# EAGLE design DCDC_ACCUMULATOR (EAGLE 9.2.1)
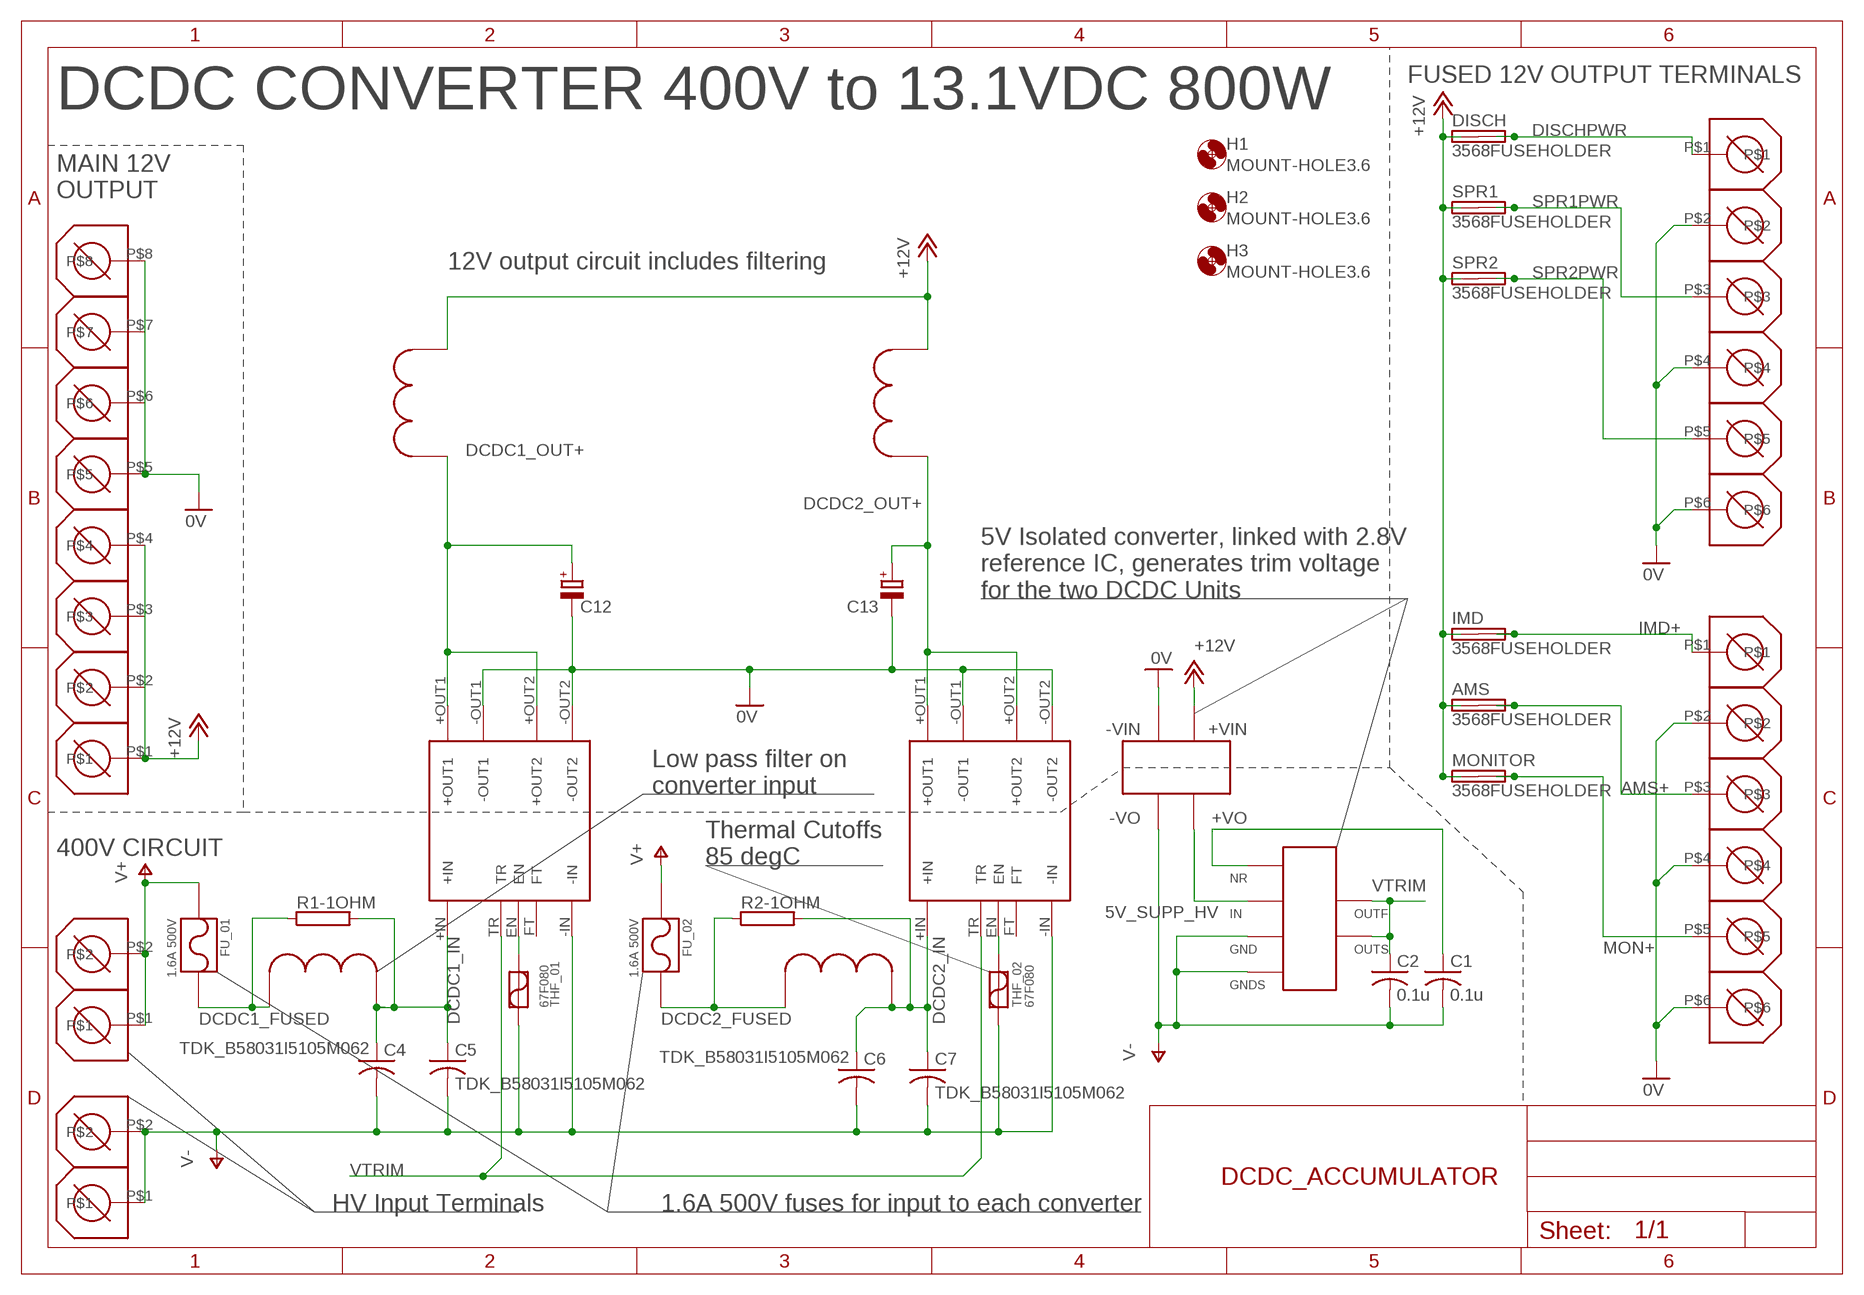
[diagram p0: schematic, sheet 1]

## Parts
AMS  3568FUSEHOLDER  [3568]
C1  0.1u  C-USC0805  [C0805]
C2  0.1u  C-USC0805  [C0805]
C4  TDK_B58031I5105M062  [TDK_CERALINK_USTYLE]
C5  TDK_B58031I5105M062  [TDK_CERALINK_USTYLE]
C6  TDK_B58031I5105M062  [TDK_CERALINK_USTYLE]
C7  TDK_B58031I5105M062  [TDK_CERALINK_USTYLE]
C12  CPOL-EUE7.5-16  [E7,5-16]
C13  CPOL-EUE7.5-16  [E7,5-16]
DISCH  3568FUSEHOLDER  [3568]
FU_01  1.6A 500V  LF_885  [LF_885]
FU_02  1.6A 500V  LF_885  [LF_885]
H1  MOUNT-HOLE3.6  [3,6]
H2  MOUNT-HOLE3.6  [3,6]
H3  MOUNT-HOLE3.6  [3,6]
IMD  3568FUSEHOLDER  [3568]
MONITOR  3568FUSEHOLDER  [3568]
R1-1OHM  RMG100-V  [TO-247-2V]
R2-1OHM  RMG100-V  [TO-247-2V]
SPR1  3568FUSEHOLDER  [3568]
SPR2  3568FUSEHOLDER  [3568]
THF_01  67F080  [TO220ACS]
THF_02  67F080  [TO220ACS]
U$1  DCM4623TD2J13D0T00  [VICOR_DCM4623TD2J13D0T00]
U$2  P1330-102H  [P1330]
U$3  MPC1250LR36C  [MPC1250LR]
U$4  DCM4623TD2J13D0T00  [VICOR_DCM4623TD2J13D0T00]
U$5  P1330-102H  [P1330]
U$6  MPC1250LR36C  [MPC1250LR]
U$9  MURATA_MEV1S1205SC  [MEV_7_PIN_SIP]
U$10  MAXIM_MAX6126A28  [UMAX]
U$13  1777600_PHOENIX  [1777600_FOOT]
U$14  1935200_PHOENIX  [1777587_FOOT]
U$15  1935200_PHOENIX  [1777587_FOOT]
U$16  282838-2_TE  [282838-2_FOOT]
U$17  282838-2_TE  [282838-2_FOOT]

## Nets
0V: C12.- C13.- U$1.-OUT1 U$1.-OUT2 U$4.-OUT1 U$4.-OUT2 U$9.-VIN U$13.P$5 U$13.P$6 U$13.P$7 U$13.P$8 U$14.P$2 U$14.P$4 U$14.P$6 U$15.P$2 U$15.P$4 U$15.P$6
5V_SUPP_HV: U$9.+VOUT(+VO) U$10.2(IN)
+12V: AMS.L1(1A) AMS.L2(1B) DISCH.L1(1A) DISCH.L2(1B) IMD.L1(1A) IMD.L2(1B) MONITOR.L1(1A) MONITOR.L2(1B) SPR1.L1(1A) SPR1.L2(1B) SPR2.L1(1A) SPR2.L2(1B) U$3.P$2 U$6.P$2 U$9.+VIN U$13.P$1 U$13.P$2 U$13.P$3 U$13.P$4
AMS+: AMS.R1(2A) AMS.R2(2B) U$15.P$3
DCDC1_FUSED [HV]: FU_01.P$2 R1-1OHM.1 U$2.P$1
DCDC1_IN [HV]: C4.P$1 C5.P$1 R1-1OHM.2 U$1.+IN U$2.P$2
DCDC1_OUT+: C12.+ U$1.+OUT1 U$1.+OUT2 U$3.P$1
DCDC1_TEMP_DISABLE: THF_01.C U$1.EN
DCDC2_FUSED [HV]: FU_02.P$2 R2-1OHM.1 U$5.P$1
DCDC2_IN [HV]: C6.P$1 C7.P$1 R2-1OHM.2 U$4.+IN U$5.P$2
DCDC2_OUT+: C13.+ U$4.+OUT1 U$4.+OUT2 U$6.P$1
DCDC2_TEMP_DISABLE: THF_02.C U$4.EN
DISCHPWR: DISCH.R1(2A) DISCH.R2(2B) U$14.P$1
IMD+: IMD.R1(2A) IMD.R2(2B) U$15.P$1
MON+: MONITOR.R1(2A) MONITOR.R2(2B) U$15.P$5
SPR1PWR: SPR1.R1(2A) SPR1.R2(2B) U$14.P$3
SPR2PWR: SPR2.R1(2A) SPR2.R2(2B) U$14.P$5
V+ [HV]: FU_01.P$1 FU_02.P$1 U$16.P$1 U$16.P$2
V-: C1.2 C2.2 C4.P$2 C5.P$2 C6.P$2 C7.P$2 THF_01.A THF_02.A U$1.-IN U$4.-IN U$9.-VOUT(-VO) U$10.3(GND) U$10.4(GNDS) U$17.P$1 U$17.P$2
VREF_NR: C1.1 U$10.1(NR)
VTRIM: C2.1 U$1.TR U$4.TR U$10.6(OUTS) U$10.7(OUTF)
Unconnected: U$1.FT U$4.FT

## Notes on the sheet
- FUSED 12V OUTPUT TERMINALS
- DCDC CONVERTER 400V to 13.1VDC 800W
- MAIN 12V
  OUTPUT
- 12V output circuit includes filtering
- 5V Isolated converter, linked with 2.8V 
  reference IC, generates trim voltage 
  for the two DCDC Units
- Low pass filter on 
  converter input
- 400V CIRCUIT
- Thermal Cutoffs 
  85 degC
- HV Input Terminals | 1.6A 500V fuses for input to each converter

## Library data of the parts
AMS DISCH IMD MONITOR SPR1 SPR2 = fuse:3568FUSEHOLDER: 3568 20AMP 500VAC
C1 C2 = rcl:C-US: CAPACITOR, American symbol; SPICEPREFIX: C
C4-C7 = 111_Custom:TDK_B58031I5105M062
C12 C13 = rcl:CPOL-EU: POLARIZED CAPACITOR, European symbol; SPICEPREFIX: C
FU_01 FU_02 = _Custom_Parts:LF_885
H1-H3 = holes:MOUNT-HOLE: MOUNTING HOLE with drill center marker
R1-1OHM R2-1OHM = resistor-power:RMG100: TO-247 Power Resistor - RMG 100 Series Source: www.token.com.tw .. power-resistor-rmg100pdf; OC_FARNELL: unknown; OC_NEWARK: unknown
THF_01 THF_02 = Custom_Parts:67F080
U$1 U$4 = Custom_Parts:DCM4623TD2J13D0T00
U$2 U$5 = DCDC_Parts:P1330-102H
U$3 U$6 = DCDC_Parts:MPC1250LR36C
U$9 = Custom_Parts:MURATA_MEV1S1205SC
U$10 = Custom_Parts:MAXIM_MAX6126A28
U$13 = DCDC_Parts:1777600_PHOENIX
U$14 U$15 = DCDC_Parts:1935200_PHOENIX
U$16 U$17 = DCDC_Parts:282838-2_TE

## Net classes
0 LV: width 0.3 mm, clearance 0.1 mm
1 HV: width 1 mm, clearance 4 mm
2 VCC_DCDC: width 0.3 mm, clearance 0.1 mm

## Board
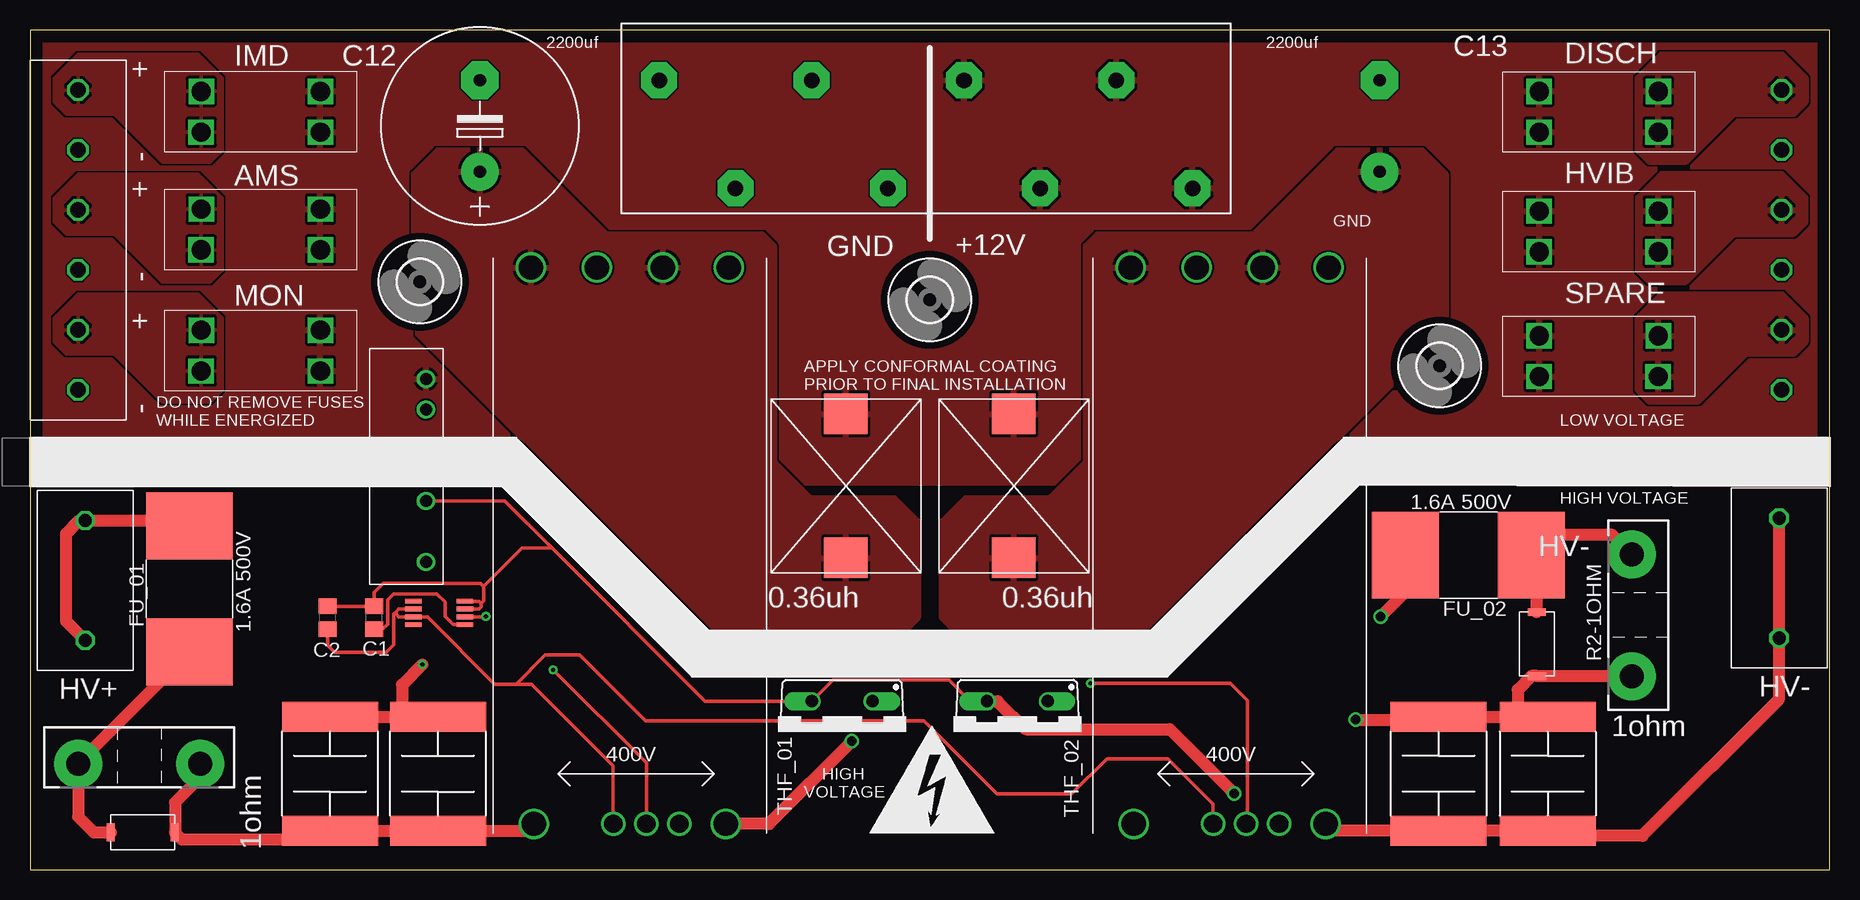
[diagram p1: board, top side]
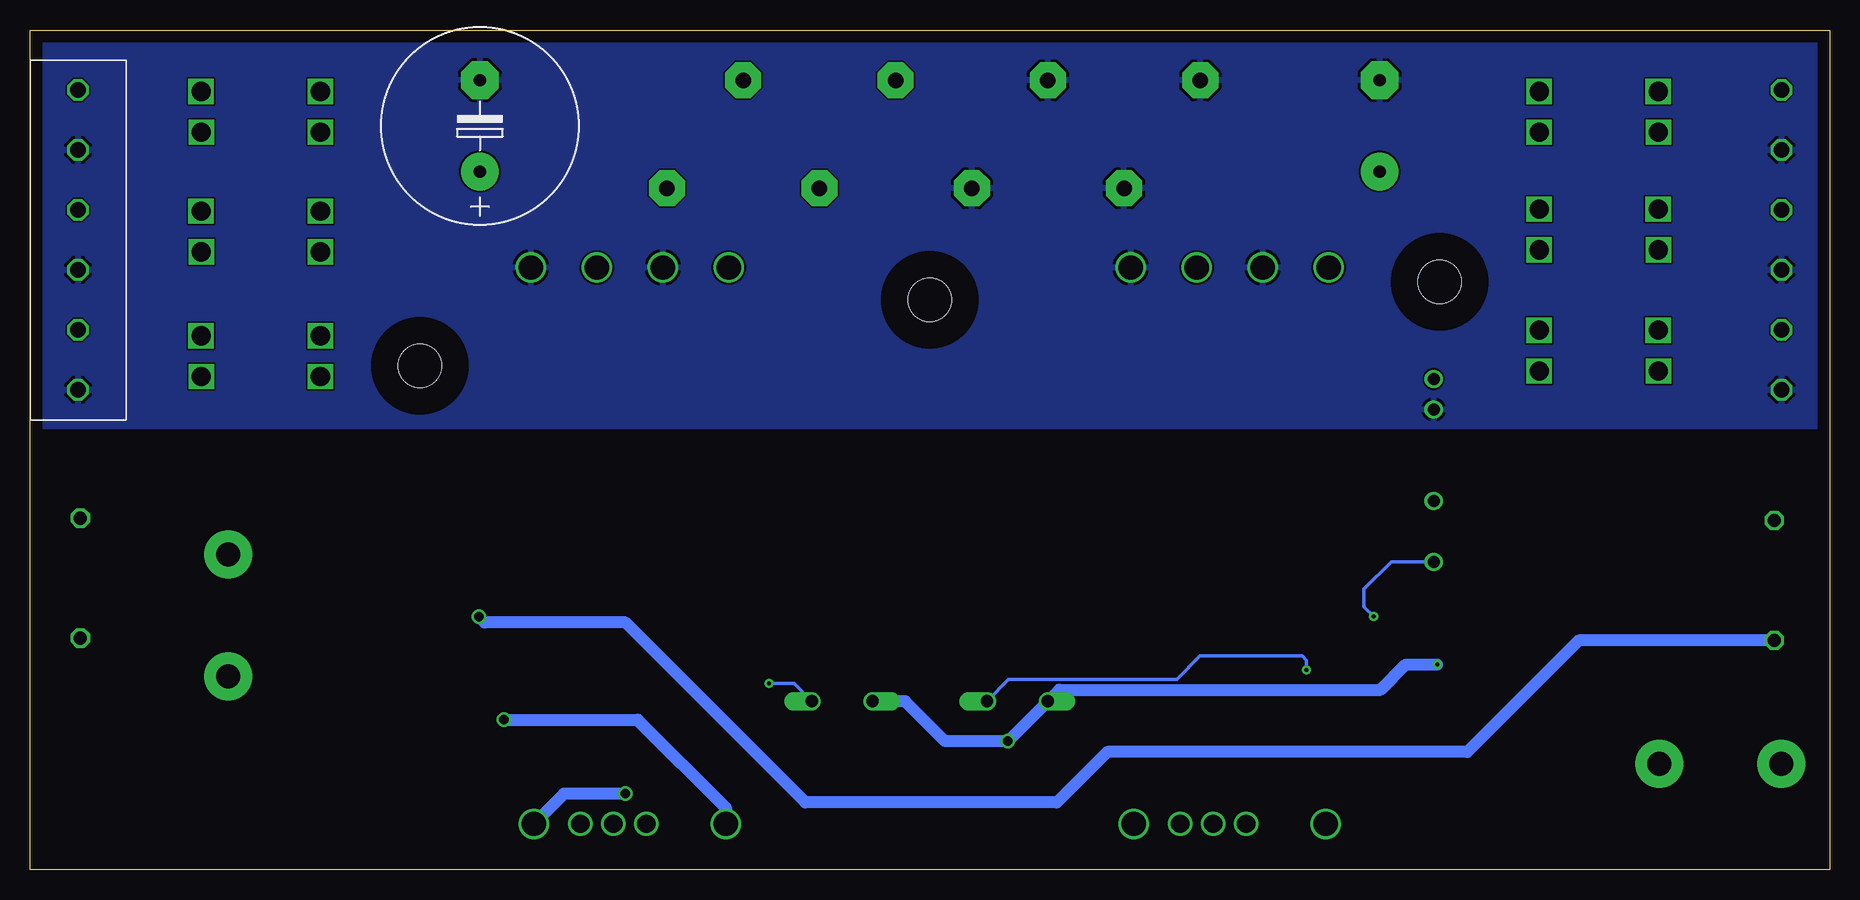
[diagram p2: board, bottom side, seen from below]

Size 150 x 70 mm. Coordinates in mm from the lower left corner, seen from the top.
Outline: 0,0 150,0 150,70 0,70 0,0
Copper layers (1*16): Top 0.035mm / dielectric 4mm / Bottom 0.035mm
Design rules "default *": minimum track width 6mil, minimum drill 0.35mm, track to track 6mil, track to pad 6mil, pad to pad 6mil, via to via 6mil, smd to smd 6mil, copper to edge 40mil, drill to drill 6mil, minimum pad ring 10mil, minimum via ring 8mil, stop-mask expansion 4mil, vias tented up to drill 0mil, thermal gap 10mil
tRestrict: 5 lines
bRestrict: 5 lines

### Footprints (pad centres in the part's own frame; a part is rotated, then mirrored left to right if it is on the bottom)
3568 = drill 1.6 square: L1 0,3.4; L2 0,0; R1 9.94,3.4; R2 9.92,0
C0805 = smd 1.3 x 1.5: 1 -0.95,0; 2 0.95,0
TDK_CERALINK_USTYLE = smd 2.5 x 8: P$1 -4.75,0; P$2 4.75,0
E7,5-16 = drill 1.016 pad 3.15: + -3.81,0 | drill 1.016 pad 3.15 octagon: - 3.81,0
LF_885 = smd 5.6 x 7.23: P$1 5.25,0; P$2 -5.25,0
3,6 = hole 3.6: 0,0
TO-247-2V = drill 2 pad 4: 1 -5.08,0; 2 5.08,0
TO220ACS = drill 1.016 offset: A 2.54,-2.54; C -2.54,-2.54
VICOR_DCM4623TD2J13D0T00 = drill 2.03 pad 2.28: +IN -23.19,8; -IN -23.19,-8 | drill 2.03 pad 2.41: +OUT1 23.19,8.25; +OUT2 23.19,-2.75; -OUT1 23.19,2.75; -OUT2 23.19,-8.25 | drill 1.52 pad 1.77: EN -23.19,-1.38; FT -23.19,-4.13; TR -23.19,1.38
P1330 = smd 0.635 x 1.524: P$1 -2.667,0; P$2 2.667,0
MPC1250LR = smd 3.4 x 3.6: P$1 -6,0; P$2 6,0
MEV_7_PIN_SIP = drill 1: +VIN 0,0; +VOUT 15.24,0; -VIN 2.54,0; -VOUT 10.16,0
UMAX = smd 1.35 x 0.4: 1 -2.15,0.975; 2 -2.15,0.325; 3 -2.15,-0.325; 4 -2.15,-0.975; 5 2.15,-0.975; 6 2.15,-0.325; 7 2.15,0.325; 8 2.15,0.975
1777600_FOOT = drill 1.3 pad 3 octagon: P$1 0,0; P$2 6.35,-9; P$3 12.7,0; P$4 19.05,-9; P$5 25.4,0; P$6 31.75,-9; P$7 38.1,0; P$8 44.45,-9
1777587_FOOT = drill 1.3 octagon: P$1 0,0; P$2 5,0; P$3 10,0; P$4 15,0; P$5 20,0; P$6 25,0
282838-2_FOOT = drill 1.1 octagon: P$1 0,0; P$2 10,0

### Placement (x,y rotation side)
AMS  24.2,55.06 180 top
C1  28.7,21 90 top
C2  24.8,21 90 top
C4  25,8 90 top
C5  34,8 90 top
C6  117.4,8 270 top
C7  126.5,8 270 top
C12  37.5,62 90 top
C13  112.5,62 90 bottom
DISCH  125.8,61.48 0 top
FU_01  13.3,23.4 90 top
FU_02  119.9,26.2 180 top
H1  75,47.5 0 top
H2  32.5,49 0 top
H3  117.5,42 0 top
IMD  24.2,64.88 180 top
MONITOR  24.2,44.97 180 top
R1-1OHM  9.1,8.8 0 top
R2-1OHM  133.5,21.2 270 top
SPR1  125.8,51.5 0 top
SPR2  125.8,41.1 0 top
THF_01  67.7,11.5 180 top
THF_02  82.3,11.5 180 top
U$1  50,27 90 top
U$2  9.4,3.1 0 top
U$3  68,32 90 top
U$4  100,27 90 top
U$5  125.6,18.8 270 top
U$6  82,32 90 top
U$9  33,40.9 270 top
U$10  34.1,21.4 180 top
U$13  96.9,56.8 180 top
U$14  146,65 270 bottom
U$15  4,65 270 top
U$16  4.6,19.1 90 top
U$17  145.8,19.3 90 top

### Tracks (layer width: path | path; a pad name or v marks a point on that pad's centre or on a via)
0V
  pour Bottom: -1.8,71 150,71 150,37 -1.8,37
5V_SUPP_HV  (via drill 0.35)
  Top 0.3: v38,21.1 37.98,21.07 U$10.2
  Bottom 0.3: U$9.+VOUT 36.54,25.66 38.8,23.4 38.8,21.9 v38,21.1
+12V
  pour Top (rank 2): -0.7,72.3 150,72.3 150,32.25 -0.7,32.25
AMS+
  pour Top: 15,49 16,50 16,56 14,58 4,58 2,56 2,54 3,53 7,53 11,49
DCDC1_FUSED
  Top 1: FU_01.P$2 4.02,8.87 R1-1OHM.1 4.02,4.41 5.33,3.1 U$2.P$1
DCDC1_IN
  Top 1: R1-1OHM.2 14.18,7.68 12.1,5.6 12.1,3.13 U$2.P$2 12.67,2.5 24.25,2.5 C4.P$1 C5.P$1 41.44,3.25 U$1.+IN
DCDC1_OUT+
  pour Top: 34,60 41,60 48,53 61,53 62,52 62,34 65,31 72,31 74,29 74,21 73,20 57,20 32,45 32,58
DCDC1_TEMP_DISABLE  (via drill 0.35)
  Top 0.3: U$1.EN 51.38,8.88 v43.6,16.66
  Bottom 0.3: v43.6,16.66 43.6,17.46 43.94,17.8 52.46,17.8 54.41,15.85 68.43,15.85 THF_01.C
DCDC2_FUSED
  Top 1: U$5.P$1 125.6,25.75 FU_02.P$2 125.15,26.65 126.4,27.9 131.88,27.9 R2-1OHM.1
DCDC2_IN  (via drill 0.8)
  Top 1: R2-1OHM.2 125.61,16.12 U$5.P$2 125.13,16.13 124,15 124,12.75 | v110.5,12.5 117.15,12.5 C6.P$1 124,12.75 | 124,12.75 C7.P$1
  Bottom 1: v110.5,12.5 99.34,12.5 92,5.16 U$4.+IN
DCDC2_OUT+
  pour Top: 76,29 78,31 85,31 88,34 88,52 89,53 102,53 109,60 116,60 118,58 118,45 93,20 77,20 76,21
DCDC2_TEMP_DISABLE  (via drill 0.35)
  Top 0.3: v88.39,15.52 100.08,15.52 101.48,14.12 101.48,3.91 U$4.EN
  Bottom 0.3: THF_02.C 86.32,15.52 v88.39,15.52
DISCHPWR
  pour Top: 134,66 136,68 146,68 148,66 148,64 147,63 142,63 138,59 135,59 134,60
IMD+
  pour Top: 3,63 2,64 2,66 4,68 14,68 16,66 16,60 15,59 11,59 7,63
MON+
  pour Top: 2,44 2,46 4,48 14,48 16,46 16,40 15,39 11,39 7,43 3,43
SPR1PWR
  pour Top: 135,49 138,49 142,53 147,53 148,54 148,56 146,58 136,58 134,56 134,50
SPR2PWR
  pour Top: 134,46 136,48 146,48 148,46 148,44 147,43 143,43 139,39 135,39 134,40
V+  (via drill 0.8)
  Top 1: FU_02.P$1 114.7,26.15 114.7,23.2 v112.6,21.1 | U$16.P$1 3,20.7 3,28 4.1,29.1 U$16.P$2 12.85,29.1 FU_01.P$1
  Bottom 1: v112.6,21.1 112.1,20.6 100.37,20.6 85.37,5.6 64.4,5.6 60.19,9.81 30.19,9.81 20.9,19.1 U$16.P$1
V-  (via drill 0.35, 0.8)
  Top 0.3: U$10.3 37.42,21.73 37.6,21.9 37.6,22.2 | 37.6,22.2 37.42,22.38 U$10.4 | 37.6,22.2 37.8,22.4 37.8,23.6 | C2.2 C1.2 28.7,23.1 29.45,23.85 37.55,23.85 37.8,23.6 | U$9.-VOUT 39.56,30.74 43.5,26.8 | 43.5,26.8 56.26,14.04 THF_01.A 66.92,15.8 76.6,15.8 78.36,14.04 THF_02.A | 37.8,23.6 41,26.8 43.5,26.8
  Top 1: U$17.P$2 U$17.P$1 145.8,14.2 134.4,2.8 126.95,2.8 C7.P$2 C6.P$2 108.56,3.25 U$4.-IN | v68.5,10.7 61.61,3.81 U$1.-IN | v100.38,6.32 95,11.7 83,11.7 80.66,14.04 THF_02.A | C4.P$2 31.1,12.75 | 31.1,12.75 C5.P$2 | v32.7,17.1 31,15.4 31,12.85 31.1,12.75
  Bottom 1: v100.38,6.32 105.49,6.32 U$4.-IN | THF_02.A 77.06,14.04 73.72,10.7 v68.5,10.7 THF_01.A 64.2,15 37.4,15 35.3,17.1 v32.7,17.1
VREF_NR
  Top 0.3: C1.1 29.4,20.05 29.8,20.45 29.8,22.5 30.3,23 33.9,23 34.6,22.3 34.6,21.1 35.27,20.43 U$10.1
VTRIM
  Top 0.3: U$10.6 30.73,21.73 30.5,21.5 | 30.5,21.5 30.5,21.3 30.73,21.07 U$10.7 33.12,21.07 38.74,15.46 40.5,15.46 | 30.5,21.5 30.33,21.33 30.33,18.73 29.7,18.1 25.39,18.1 24.8,18.69 C2.1 | U$4.TR 98.6,3.83 98.6,5.5 94.87,9.23 89.75,9.23 86.83,6.3 80.6,6.3 74.5,12.4 51.32,12.4 45.82,17.9 42.94,17.9 40.5,15.46 | U$1.TR 48.62,8.64 41.8,15.46 40.5,15.46

### Text on the board
tPlace: 2200uf | 2200uf | IMD | DISCH | + | - | AMS | HVIB | + | GND | GND | +12V | - | MON | SPARE | + | APPLY CONFORMAL COATING / PRIOR TO FINAL INSTALLATION | - | DO NOT REMOVE FUSES / WHILE ENERGIZED | LOW VOLTAGE | HIGH VOLTAGE | HV- | 0.36uh | 0.36uh | HV+ | HV- | 1ohm | 1ohm | HIGH | VOLTAGE